# EAGLE design mav_nus_adapter (EAGLE 7.6.0)
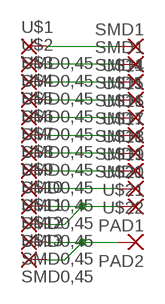
[diagram p0: schematic, sheet 1]

## Parts
PAD1  SMD2  [SMD1,27-2,54]
PAD2  SMD2  [SMD1,27-2,54]
U$1  SMD0,45  [SMD0,45-1,35]
U$2  SMD0,45  [SMD0,45-1,35]
U$3  SMD0,45  [SMD0,45-1,35]
U$4  SMD0,45  [SMD0,45-1,35]
U$5  SMD0,45  [SMD0,45-1,35]
U$6  SMD0,45  [SMD0,45-1,35]
U$7  SMD0,45  [SMD0,45-1,35]
U$8  SMD0,45  [SMD0,45-1,35]
U$9  SMD0,45  [SMD0,45-1,35]
U$10  SMD0,45  [SMD0,45-1,35]
U$11  SMD0,45  [SMD0,45-1,35]
U$12  SMD0,45  [SMD0,45-1,35]
U$13  SMD0,45  [SMD0,45-1,35]
U$14  SMD1  [SMD0,8-1,6]
U$15  SMD1  [SMD0,8-1,6]
U$16  SMD1  [SMD0,8-1,6]
U$17  SMD1  [SMD0,8-1,6]
U$18  SMD1  [SMD0,8-1,6]
U$19  SMD1  [SMD0,8-1,6]
U$20  SMD1  [SMD0,8-1,6]
U$21  SMD1  [SMD0,8-1,6]
U$22  SMD1  [SMD0,8-1,6]

## Nets
N$1: U$1.P$1(P) U$14.P$1(P)
N$2: U$2.P$1(P) U$15.P$1(P)
N$3: U$3.P$1(P) U$16.P$1(P)
N$4: U$4.P$1(P) U$17.P$1(P)
N$5: U$5.P$1(P) U$18.P$1(P)
N$6: U$6.P$1(P) U$19.P$1(P)
N$7: U$7.P$1(P) U$20.P$1(P)
N$8: U$8.P$1(P) U$21.P$1(P)
N$9: U$9.P$1(P) U$22.P$1(P)
N$10: PAD1.1(P) U$10.P$1(P) U$11.P$1(P)
N$11: PAD2.1(P) U$12.P$1(P) U$13.P$1(P)

## Library data of the parts
PAD1 PAD2 = wirepad:SMD2: SMD PAD
U$1-U$13 = wirepad:SMD0,45
U$14-U$22 = wirepad:SMD1

## Board
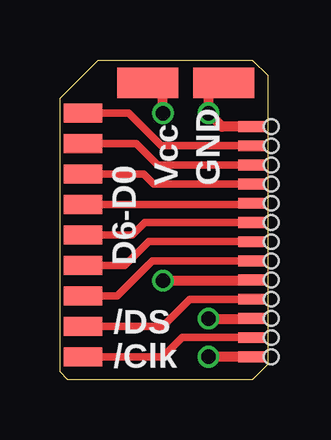
[diagram p1: board, top side]
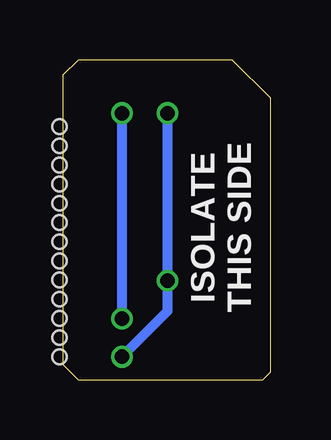
[diagram p2: board, bottom side, seen from below]

Size 8.65 x 13.33 mm. Coordinates in mm from the lower left corner, seen from the top.
Outline: 0,0.32 0,11.75 1.59,13.33 8.02,13.33 8.65,12.7 8.65,0.64 8.02,0 0.32,0 0,0.32
Copper layers (1*16): Top 0.035mm / dielectric 1.5mm / Bottom 0.035mm
Design rules "ITEADstudio_DRC": minimum track width 6mil, minimum drill 12mil, track to track 6mil, track to pad 6mil, pad to pad 6mil, via to via 6mil, smd to smd 0mil, copper to edge 10mil, drill to drill 10mil, minimum pad ring 10mil, minimum via ring 6mil, stop-mask expansion 2mil, vias tented up to drill 30mil, thermal gap 10mil
Holes 0.6 mm at 8.8,0.95 8.8,1.75 8.8,2.55 8.8,3.35 8.8,4.15 8.8,4.95 8.8,5.75 8.8,6.55 8.8,7.35 8.8,8.15 8.8,8.95 8.8,9.75 8.8,10.55

### Footprints (pad centres in the part's own frame; a part is rotated, then mirrored left to right if it is on the bottom)
SMD1,27-2,54 = smd 1.27 x 2.54: 1 0,0
SMD0,45-1,35 = smd 1.35 x 0.45: P$1 0,0
SMD0,8-1,6 = smd 0.8 x 1.6: P$1 0,0

### Placement (x,y rotation side)
PAD1  3.65,12.38 270 top
PAD2  6.83,12.38 270 top
U$1  8.1,5.75 0 top
U$2  8.1,4.95 0 top
U$3  8.1,3.35 0 top
U$4  8.1,1.75 0 top
U$5  8.1,6.55 0 top
U$6  8.1,7.35 0 top
U$7  8.1,8.15 0 top
U$8  8.1,8.95 0 top
U$9  8.1,9.75 0 top
U$10  8.1,4.15 0 top
U$11  8.1,0.95 0 top
U$12  8.1,2.55 0 top
U$13  8.1,10.55 0 top
U$14  0.95,4.76 90 top
U$15  0.95,3.49 90 top
U$16  0.95,2.22 90 top
U$17  0.95,0.95 90 top
U$18  0.95,6.03 90 top
U$19  0.95,7.3 90 top
U$20  0.95,8.57 90 top
U$21  0.95,9.84 90 top
U$22  0.95,11.11 90 top

### Tracks (layer width: path | path; a pad name or v marks a point on that pad's centre or on a via)
N$1
  Top 0.305: U$1.P$1 3.69,5.75 2.7,4.76 U$14.P$1
N$2
  Top 0.305: U$15.P$1 2.38,3.49 3.84,4.95 U$2.P$1
N$3
  Top 0.305: U$3.P$1 5.42,3.35 4.29,2.22 U$16.P$1
N$4
  Top 0.305: U$4.P$1 5.09,1.75 4.29,0.95 U$17.P$1
N$5
  Top 0.305: U$5.P$1 3.54,6.55 3.02,6.03 U$18.P$1
N$6
  Top 0.254: 8.05,7.3 U$6.P$1
  Top 0.305: U$19.P$1 8.05,7.3
N$7
  Top 0.305: U$7.P$1 3.91,8.15 3.49,8.57 U$20.P$1
N$8
  Top 0.305: U$8.P$1 4.07,8.95 3.18,9.84 U$21.P$1
N$9
  Top 0.305: U$9.P$1 4.22,9.75 2.86,11.11 U$22.P$1
N$10  (via drill 0.6)
  Top 0.356: 8.07,4.13 U$10.P$1
  Top 0.406: U$11.P$1 v6.19,0.95 | v4.29,4.13 8.07,4.13 | v4.29,11.11 4.29,12.38 PAD1.1
  Bottom 0.406: v6.19,0.95 4.29,2.86 v4.29,4.13 v4.29,11.11
N$11  (via drill 0.6)
  Top 0.356: 8.08,2.54 U$12.P$1 | 6.19,12.38 PAD2.1
  Top 0.406: U$13.P$1 6.75,10.55 v6.19,11.11 6.19,12.38 | v6.19,2.54 8.08,2.54
  Bottom 0.406: v6.19,11.11 v6.19,2.54

### Text on the board
tNames: Vcc | GND | D6-D0 | /DS | /Clk
bNames: ISOLATE / THIS SIDE